# EasyEDA Pro project 25工创PCB.eprj, schematic 主控板原理图
Board Name: 主控板; Create Date: 2024-12-12; Page Name: P1; Project Name: 25工创PCB; Schematic Name: Schematic1; Update Date: 2024-12-15; Company: 嘉立创EDA; Page Size: A4; Version: V1.0
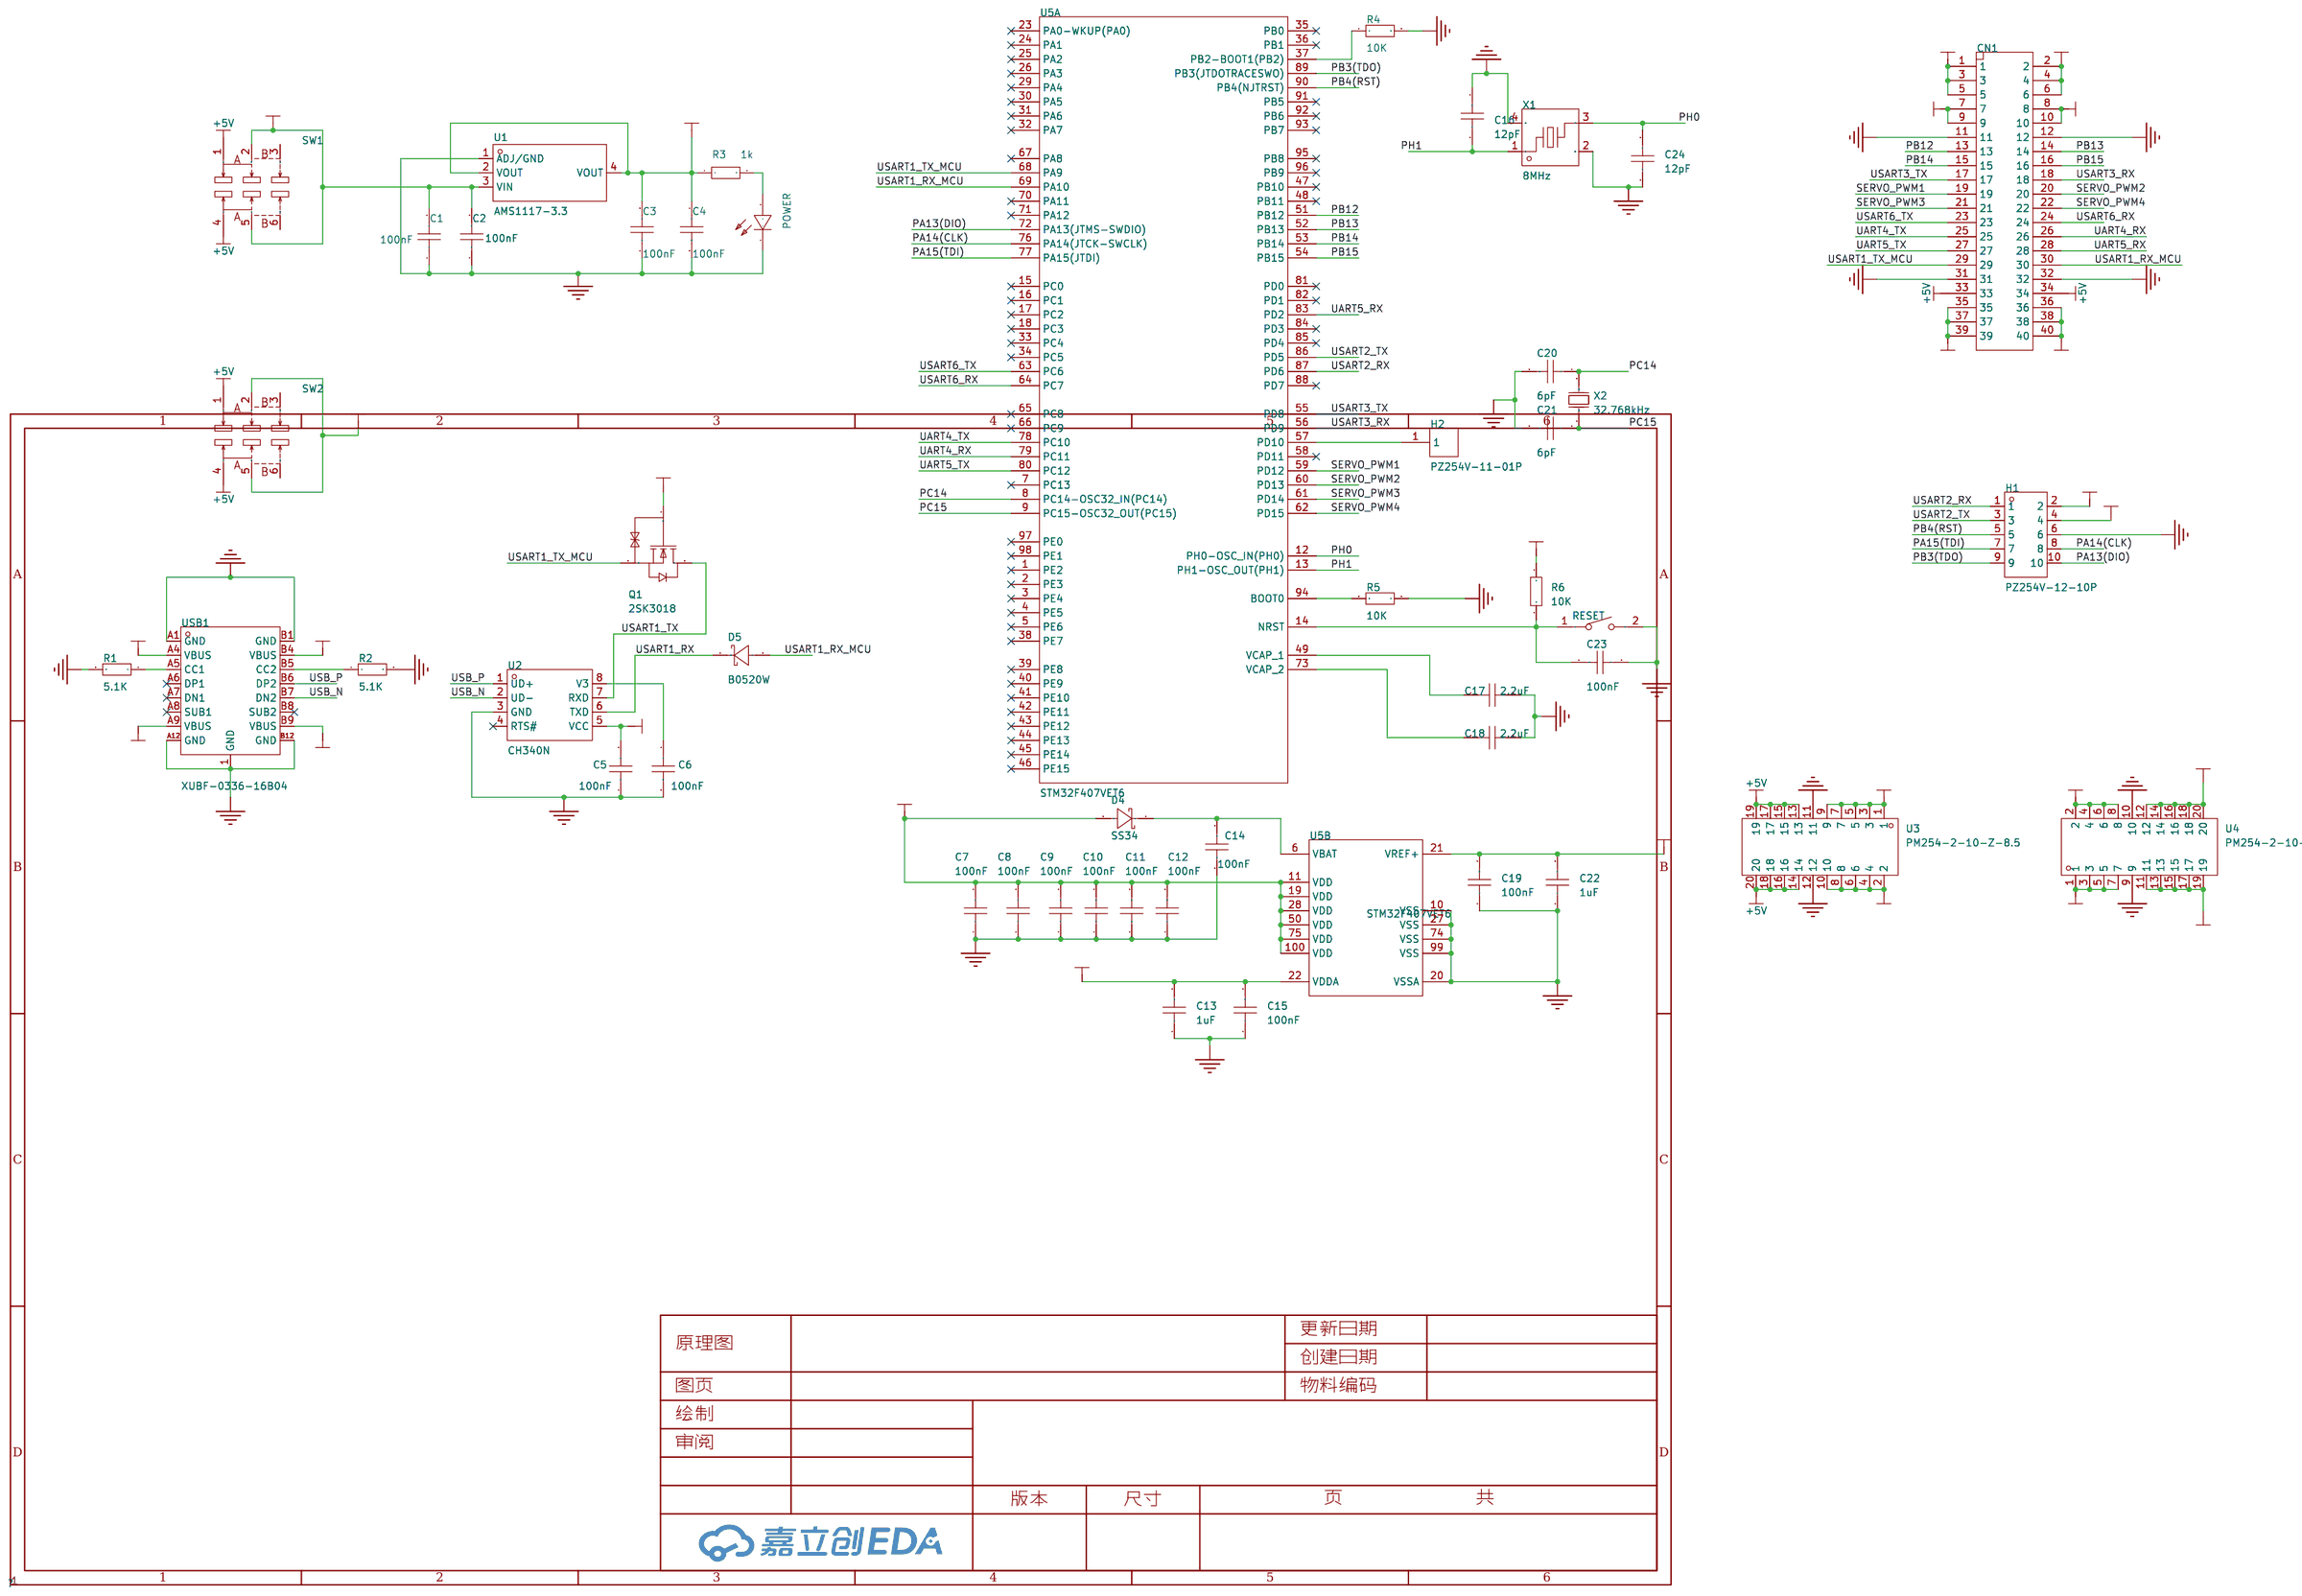
[diagram p1: schematic sheet]

## Parts
C1  100nF  [C0603]
C2  100nF  [C0603]
C3  100nF  [C0603]
C4  100nF  [C0603]
C5  100nF  [C0603]
C6  100nF  [C0603]
C7  100nF  [C0603]
C8  100nF  [C0603]
C9  100nF  [C0603]
C10  100nF  [C0603]
C11  100nF  [C0603]
C12  100nF  [C0603]
C13  1uF  [C0603]
C14  100nF  [C0603]
C15  100nF  [C0603]
C16  100nF  [C0603]
C17  100nF  [C0603]
C18  100nF  [C0603]
C19  100nF  [C0603]
C20  100nF  [C0603]
C21  100nF  [C0603]
C22  1uF  [C0603]
C23  100nF  [C0603]
C24  100nF  [C0603]
CN1  B-3000R40P-0110  [IDC-TH_40P-P2.54_300R-40P]
D4  SS34  [SMA_L4.3-W2.5-LS5.0-RD]
D5  B0520W  [SOD-123_L2.7-W1.6-LS3.7-RD]
H1  PZ254V-12-10P  [HDR-TH_10P-P2.54-V-M-R2-C5-S2.54]
H2  PZ254V-11-01P  [HDR-TH_1P-P2.54-V-M]
POWER  Blue  [LED0603-RD]
Q1  2SK3018  [SOT-323-3_L2.0-W1.3-P1.30-LS2.1-BR]
R1  5.1K  [R0603]
R2  5.1K  [R0603]
R3  10K  [R0603]
R4  10K  [R0603]
R5  10K  [R0603]
R6  10K  [R0603]
RESET  TS-1088-AR02016  [SW-SMD_L3.9-W3.0-P4.45]
SW1  MST22D18G2 125  [SW-SMD_MST22D18G2]
SW2  MST22D18G2 125  [SW-SMD_MST22D18G2]
U1  AMS1117-3.3  [SOT-223_L6.5-W3.5-P2.30-LS7.0-BR]
U2  CH340N  [SOP-8_L4.9-W3.9-P1.27-LS6.0-BL]
U3  PM254-2-10-Z-8.5  [HDR-TH_20P-P2.54-V-F-R2-C10-S2.54]
U4  PM254-2-10-Z-8.5  [HDR-TH_20P-P2.54-V-F-R2-C10-S2.54]
U5  STM32F407VET6  [LQFP-100_L14.0-W14.0-P0.50-LS16.0-BL]  (sections 1,2)
USB1  XUBF-0336-16B04  [USB-C-TH_XUBF-0336-16B04-1]
X1  8MHz  [OSC-SMD_4P-L3.2-W2.5-BL]
X2  32.768kHz  [crystal-smd_l3.2-w1.5_rt3215]

## Library data of the parts
C1-C24 = CAP_0603: Supplier Footprint: 0603
CN1 = B-3000R40P-0110: LCSC Part Name: 2.54mm 2x20P 排数:2 每排P数:20; Supplier Part: C146628; Manufacturer: Ckmtw(灿科盟); Supplier Footprint: 弯插,P=2.54mm; JLCPCB Part Class: 扩展库; Datasheet: https://atta.szlcsc.com/upload/public/pdf/source/20180105/C132444_15151572301921234454.pdf; Supplier: LCSC; Connector Type: 简牛座; Pitch: 2.54mm; Structure: 2x20P; Holder Type: 弯插; Row Spacing: 2.54mm; Number of Rows: 2; Pin Number in each Row: 20; Contact Material: 黄铜; Contact Plating: 金
D4 = SS34_C727060: 二极管配置:独立式;正向压降(Vf):550mV@3A;直流反向耐压(Vr):40V;平均整流电流(Io):3A;; LCSC Part Name: 电压:40V 电流:3A; Supplier Part: C727060; Manufacturer: TWGMC(台湾迪嘉); Supplier Footprint: SMA(DO-214AC); JLCPCB Part Class: 扩展库; Datasheet: https://atta.szlcsc.com/upload/public/pdf/source/20200828/C727059_6599B6CAC5F3238B9C33E46794659DBE.pdf; Supplier: LCSC; Diode Configuration: 独立式; Forward Voltage (Vf@If): 550mV@3A; Reverse Voltage (Vr): 40V; Average Rectified Current (Io): 3A; Reverse Leakage Current (Ir): 500uA@40V
D5 = B0520W_C7502707: LCSC Part Name: 电压:20V 电流:500mA; Supplier Part: C7502707; Manufacturer: 宏迦橙; Supplier Footprint: SOD-123; JLCPCB Part Class: 扩展库; Datasheet: https://atta.szlcsc.com/upload/public/pdf/source/20230828/3BC5471C81D8F1E4F5A2EB1F4EDE09E2.pdf; Supplier: LCSC; Diode Configuration: 独立式; Forward Voltage (Vf@If): 385mV@500mA; Reverse Voltage (Vr): 20V; Rectified Current: 500mA; Reverse Leakage Current (Ir): 250uA
H1 = PZ254V-12-10P: LCSC Part Name: 间距:2.54mm 2x5P 直插 方针; Supplier Part: C492422; Manufacturer: XFCN(兴飞); Supplier Footprint: 插件,P=2.54mm; JLCPCB Part Class: 扩展库; Datasheet: https://atta.szlcsc.com/upload/public/pdf/source/20200309/C492422_5020CEA01BE7051F9EA9DD81AB0A25E3.pdf; Supplier: LCSC; Pin Structure: 2x5P; Pitch: 2.54mm; Row Spacing: 2.54mm; Circluar Pins/Square Pins: 方针; Mounting Type: 直插; Number of Rows: 双排; Number of Pins: 10P; Length of Mating Pin: 6mm; Insulation Height: 2.5mm; Length of End Connection Pin: 3mm; Contact Material: 黄铜; Operating Temperature Range: -40℃~+105℃; Color: 黑色
H2 = PZ254V-11-01P: LCSC Part Name: 间距:2.54mm 1x1P 直插 方针; Supplier Part: C492400; Manufacturer: XFCN(兴飞); Supplier Footprint: 插件,P=2.54mm; JLCPCB Part Class: 扩展库; Datasheet: https://atta.szlcsc.com/upload/public/pdf/source/20200309/C492400_46876A5B545F5AE6B8D4A09C46E276E8.pdf; Supplier: LCSC; Pin Structure: 1x1P; Pitch: 2.54mm; Circluar Pins/Square Pins: 方针; Mounting Type: 直插; Number of Rows: 单排; Number of Pins: 1P; Length of Mating Pin: 6mm; Insulation Height: 2.5mm; Length of End Connection Pin: 3mm; Contact Material: 黄铜; Operating Temperature Range: -40℃~+105℃; Color: 黑色
POWER = NCD0603B1: 发光颜色:蓝灯;; LCSC Part Name: 蓝灯; Supplier Part: C84266; Manufacturer: 国星光电; Supplier Footprint: 0603; JLCPCB Part Class: Extended Part; Datasheet: https://atta.szlcsc.com/upload/public/pdf/source/20200820/C84266_6A3CDBEFA72C6CAD68EDA53474ADAE6C.pdf; Supplier: LCSC; Emitted Color: 蓝灯
Q1 = 2SK3018_C194460: LCSC Part Name: N沟道 耐压:30V 电流:100mA; Supplier Part: C194460; Manufacturer: CJ(江苏长电/长晶); Supplier Footprint: SOT-323-3; JLCPCB Part Class: 扩展库; Datasheet: https://atta.szlcsc.com/upload/public/pdf/source/20180612/C194460_7DCC01674DB4E554C67F4CC0517F82F1.pdf; Supplier: LCSC; Type: N沟道; Drain Source Voltage (Vdss): 30V; Continuous Drain Current (Id): 100mA; Power Dissipation (Pd): 200mW; Drain Source On Resistance (RDS(on)@Vgs,Id): 8Ω@4V,10mA; Gate Threshold Voltage (Vgs(th)@Id): 1.5V; Input Capacitance (Ciss@Vds): 13pF; Reverse Transfer Capacitance (Crss@Vds): 4pF
R1-R6 = Res_0603: Supplier Footprint: 0603
RESET = TS-1088-AR02016: +POW; LCSC Part Name: 4*3*2mm 立贴 轻触开关; Supplier Part: C720477; Manufacturer: XUNPU(讯普); Supplier Footprint: SMD; JLCPCB Part Class: Extended Part; Datasheet: https://atta.szlcsc.com/upload/public/pdf/source/20200810/C720475_60D09DD6C54279ADDB2DC25100F1CC11.pdf; Supplier: LCSC; Contact Current: 50mA; Voltage Rating (DC): +POW; Insulation Resistance: 100MΩ; Circuit: 单刀单掷; Mounting Style: 立贴; Actuator Style: 圆形按钮; Actuator/Cap Color: 黑色; Operating Force: 160gf@±50gf; Mechanical Life: 10万次; Operating Temperature: -30~+80; Pin Style: SMD接片; Switch Length: 4mm; Switch Width: 3mm; Switch Height: 2mm; Strike Gundam: 否
SW1 SW2 = MST22D18G2 125: LCSC Part Name: 拨动开关/两档立式 6脚贴片 柄长2.0mm 大六立贴 9.1*3.5mm; Supplier Part: C2906280; Manufacturer: SHOU HAN(首韩); Supplier Footprint: SMD; JLCPCB Part Class: 扩展库; Datasheet: https://atta.szlcsc.com/upload/public/pdf/source/20211019/449AD4EDF23AADA7A5C4E3C063EDBB30.pdf; Supplier: LCSC; Circuit: 双刀双掷; Pin Style: 鸥翼型; Mounting Style: 立贴; Actuator Color: 黑色; Current Rating (DC): 100mA; Voltage Rating (DC): 12V; Mechanical Life: 1万次; Operating Temperature: -25℃~+70℃
U1 = AMS1117-3.3_C426566: 输出类型:固定;输出极性:正;输出通道数:1;最大输入电压:18V;输出电压:3.3V;压差:1.4V@(1A);输出电流:1A;电源纹波抑制比(PSRR):70dB@(120Hz);; LCSC Part Name: 正 Vin=18V Vout=3.3V 1A 70dB@(120Hz); Supplier Part: C426566; Manufacturer: Slkor(萨科微); Supplier Footprint: SOT-223; JLCPCB Part Class: Extended Part; Datasheet: https://atta.szlcsc.com/upload/public/pdf/source/20201231/C426566_7F22DB93439D00F3FA27143E4F28C6AA.pdf; Supplier: LCSC; Output Type: 固定; Output Polarity: 正; Number of Outputs: 1; Maximum Input Voltage: 18V; Output Voltage: 3.3V; Dropout Voltage: 1.4V@(1A); Output Current: 1A; Power Supply Rejection Ratio (PSRR): 70dB@(120Hz)
U2 = CH340N: LCSC Part Name: USB转串口芯片 CH340; Supplier Part: C2977777; Manufacturer: WCH(南京沁恒); Supplier Footprint: SOP-8; JLCPCB Part Class: 扩展库; Datasheet: https://atta.szlcsc.com/upload/public/pdf/source/20230530/6E401E9554E9F5311886CC8B3F89B62E.pdf; Supplier: LCSC
U3 U4 = PM254-2-10-Z-8.5: 插孔结构:2x10P;间距:2.54mm;行距:2.54mm;圆孔/方孔:方孔;安装类型:直插;排数:双排;总孔位数:20P;额定电流:3A;额定电压:-;插孔方向:顶部;塑高:8.5mm;触头材质:铜合金;工作温度范围:-40℃~+105℃;焊接温度(最大值):260℃@5S;; LCSC Part Name: 2x10P 间距:2.54mm 直插; Supplier Part: C2897411; Manufacturer: HCTL(华灿天禄); Supplier Footprint: 插件,P=2.54mm; JLCPCB Part Class: 扩展库; Datasheet: https://atta.szlcsc.com/upload/public/pdf/source/20230609/3D36CA2C1BFC9FD1C3F709AD9DFEB9C2.pdf; Supplier: LCSC; Holes Structure: 2x10P; Pitch: 2.54mm; Row Spacing: 2.54mm; Circular Hole / Square Hole: 方孔; Mounting Type: 直插; Number of Rows: 双排; Number of Holes: 20P; Current Rating (Max): 3A; Holes Direction: 顶部; Insulation Height: 8.5mm; Contact Material: 铜合金; Operating Temperature Range: -40℃~+105℃; Soldering Temperature(Max): 260℃@5S
U5 = STM32F407VET6: CPU内核:CM4;程序存储容量:512KB;RAM总容量:192KB;GPIO端口数量:82;工作电压范围:1.8V~3.6V;CPU最大主频:168MHz;程序存储器类型:FLASH;; Supplier Part: C28730; Manufacturer: ST(意法半导体); Supplier Footprint: LQFP-100(14x14); JLCPCB Part Class: 扩展库; Datasheet: https://atta.szlcsc.com/upload/public/pdf/source/20140801/1457707197138.pdf; Supplier: LCSC; CPU Core: CM4; Program Storage Size: 512KB; RAM Size: 192KB; GPIO Ports Number: 82; Operating Voltage Range: 1.8V~3.6V; CPU Maximum Speed: 168MHz; Program Memory Type: FLASH; Operating Temperature Range: -40℃~+85℃; ADC (Bit): 12bit; DAC (Bit): 12bit; Universal Serial Bus: 有; Peripheral/Function: DMA；LCD/LED驱动；PWM; Watchdog: 有; Infrared Data Association: 有; Low-Voltage Detect: 有; LCD Module: 有; Direct Memory Access: 有; Internal Oscillator: 有
USB1 = XUBF-0336-16B04: LCSC Part Name: Type-C 母; Supplier Part: C21882465; Manufacturer: LX(连欣科技); Supplier Footprint: 插件; JLCPCB Part Class: 扩展库; Datasheet: https://atta.szlcsc.com/upload/public/pdf/source/20240308/20BF57A3312F4E1817EDC1EC8BC48CB2.pdf; Supplier: LCSC; Connector Type: Type-C; Gender: 母; Number of Contacts: 16Px2; Number of Ports: 2
X1 = X32258MOB4SI: 晶振类型:贴片晶振;频率:8MHz;常温频差:±10ppm;外接负载电容:12pF;频率稳定度(全温):±20ppm;; LCSC Part Name: 8MHz ±10ppm 12pF; Supplier Part: C2682775; Manufacturer: YXC(扬兴晶振); Supplier Footprint: SMD3225-4P; JLCPCB Part Class: 扩展库; Datasheet: https://atta.szlcsc.com/upload/public/pdf/source/20240329/19D5F850207469550BEB00D7DFEDBC7A.pdf; Supplier: LCSC; Crystal Type: 贴片晶振; Normal temperature Frequency Tolerance: ±10ppm; External load capacitor: 12pF; Frequency Stability(Full temperature range): ±20ppm; Equivalent Series Resistance (ESR): 150Ω; Operating Temperature: -40℃~+85℃
X2 = 贴片晶振32.768KHz12.5PF20ppm封装:1610-2P: Supplier Part: C9900012694; Supplier Footprint: SMD-1610-2P; JLCPCB Part Class: Extended Part; Datasheet: https://atta.szlcsc.comnull; Supplier: LCSC

## Nets
24V_1: CN1.35 CN1.36 CN1.37 CN1.38 CN1.39 CN1.40 U3.1 U3.2 U3.3 U3.4 U3.5 U3.6 U3.7 U3.8 U3.9 U3.10
24V_2: CN1.1 CN1.2 CN1.3 CN1.4 CN1.5 CN1.6 U4.11 U4.12 U4.13 U4.14 U4.15 U4.16 U4.17 U4.18 U4.19 U4.20
+3V3: C3.2 C4.1 C7.2 C8.2 C9.2 C10.2 C11.2 C12.2 C13.2 C15.2 C19.2 C22.2 D4.2(A) H1.4 Q1.1(G) R3.1 R6.2 U1.2(VOUT) U1.4(VOUT) U5.11(VDD) U5.19(VDD) U5.21(VREF+) U5.22(VDDA) U5.28(VDD) U5.50(VDD) U5.75(VDD) U5.100(VDD)
+5V: CN1.33 CN1.34 SW1.1 SW1.4 SW2.1 SW2.4 U3.13 U3.14 U3.15 U3.16 U3.17 U3.18 U3.19 U3.20
+5V_MCU: C1.2 C2.2 H1.2 SW1.2 SW1.5 U1.3(VIN)
+5V_PI: C5.2 SW2.2 SW2.5 U2.5(VCC) USB1.A4(VBUS) USB1.A9(VBUS) USB1.B4(VBUS) USB1.B9(VBUS)
+6V: CN1.7 CN1.8 CN1.9 CN1.10 U4.1 U4.2 U4.3 U4.4 U4.5 U4.6 U4.7 U4.8
GND: C1.1 C2.1 C3.1 C4.2 C5.1 C6.2 C7.1 C8.1 C9.1 C10.1 C11.1 C12.1 C13.1 C14.1 C15.1 C16.1 C17.2 C18.2 C19.1 C20.2 C21.2 C22.1 C23.2 C24.1 CN1.11 CN1.12 CN1.31 CN1.32 H1.6 POWER.1(-) R1.2 R2.2 R4.2 R5.1 RESET.2 U1.1(ADJ/GND) U2.3(GND) U3.11 U3.12 U4.9 U4.10 U5.10(VSS) U5.20(VSSA) U5.27(VSS) U5.74(VSS) U5.99(VSS) USB1.1(GND) USB1.A1(GND) USB1.A12(GND) USB1.B1(GND) USB1.B12(GND) X1.2(GND) X1.4(GND)
PA13(DIO): H1.10 U5.72(PA13(JTMS-SWDIO))
PA14(CLK): H1.8 U5.76(PA14(JTCK-SWCLK))
PA15(TDI): H1.7 U5.77(PA15(JTDI))
PB3(TDO): H1.9 U5.89(PB3(JTDOTRACESWO))
PB4(RST): H1.5 U5.90(PB4(NJTRST))
PB12: CN1.13 U5.51(PB12)
PB13: CN1.14 U5.52(PB13)
PB14: CN1.15 U5.53(PB14)
PB15: CN1.16 U5.54(PB15)
PC14: C20.1 U5.8(PC14-OSC32_IN(PC14)) X2.2(OSC2)
PC15: C21.1 U5.9(PC15-OSC32_OUT(PC15)) X2.1(OSC1)
PH0: C24.2 U5.12(PH0-OSC_IN(PH0)) X1.3
PH1: C16.2 U5.13(PH1-OSC_OUT(PH1)) X1.1
SERVO_PWM1: CN1.19 U5.59(PD12)
SERVO_PWM2: CN1.20 U5.60(PD13)
SERVO_PWM3: CN1.21 U5.61(PD14)
SERVO_PWM4: CN1.22 U5.62(PD15)
UART4_RX: CN1.26 U5.79(PC11)
UART4_TX: CN1.25 U5.78(PC10)
UART5_RX: CN1.28 U5.83(PD2)
UART5_TX: CN1.27 U5.80(PC12)
USART1_RX: D5.1(K) U2.6(TXD)
USART1_RX_MCU: CN1.30 D5.2(A) U5.69(PA10)
USART1_TX: Q1.3(D) U2.7(RXD)
USART1_TX_MCU: CN1.29 Q1.2(S) U5.68(PA9)
USART2_RX: H1.1 U5.87(PD6)
USART2_TX: H1.3 U5.86(PD5)
USART3_RX: CN1.18 U5.56(PD9)
USART3_TX: CN1.17 U5.55(PD8)
USART6_RX: CN1.24 U5.64(PC7)
USART6_TX: CN1.23 U5.63(PC6)
USB_N: U2.2(UD-) USB1.B7(DN2)
USB_P: U2.1(UD+) USB1.B6(DP2)
$1N1713: C23.1 R6.1 RESET.1 U5.14(NRST)
$1N1715: C18.1 U5.73(VCAP_2)
$1N1716: C17.1 U5.49(VCAP_1)
$1N1732: C14.2 D4.1(C) U5.6(VBAT)
$1N1733: R5.2 U5.94(BOOT0)
$1N1744: R4.1 U5.37(PB2-BOOT1(PB2))
$1N6023: POWER.2(+) R3.2
$1N7609: C6.1 U2.8(V3)
$1N10157: R1.1 USB1.A5(CC1)
$1N10439: R2.1 USB1.B5(CC2)
$1N12945: H2.1 U5.57(PD10)

Not connected (* = marked no-connect by the designer): SW1 3 6; SW2 3 6; U2 4(RTS#)*; U5 1(PE2)* 2(PE3)* 3(PE4)* 4(PE5)* 5(PE6)* 7(PC13)* 15(PC0)* 16(PC1)* 17(PC2)* 18(PC3)* 23(PA0-WKUP(PA0))* 24(PA1)* 25(PA2)* 26(PA3)* 29(PA4)* 30(PA5)* 31(PA6)* 32(PA7)* 33(PC4)* 34(PC5)* 35(PB0)* 36(PB1)* 38(PE7)* 39(PE8)* 40(PE9)* 41(PE10)* 42(PE11)* 43(PE12)* 44(PE13)* 45(PE14)* 46(PE15)* 47(PB10)* 48(PB11)* 58(PD11)* 65(PC8)* 66(PC9)* 67(PA8)* 70(PA11)* 71(PA12)* 81(PD0)* 82(PD1)* 84(PD3)* 85(PD4)* 88(PD7)* 91(PB5)* 92(PB6)* 93(PB7)* 95(PB8)* 96(PB9)* 97(PE0)* 98(PE1)*; USB1 A6(DP1)* A7(DN1)* A8(SUB1)* B8(SUB2)*
